# Altium schematic sheet LCD.SchDoc
size Tabloid
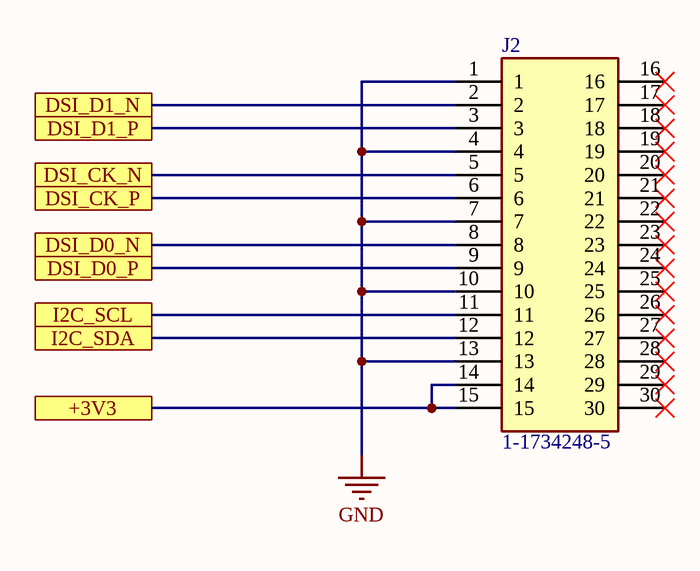
[diagram p0: LCD.SchDoc]

## Parts
J2  1-1734248-5  [117342485]

## Ports
+3V3, DSI_CK_N, DSI_CK_P, DSI_D0_N, DSI_D0_P, DSI_D1_N, DSI_D1_P, I2C_SCL, I2C_SDA

## Nets
GND: J2.1 J2.4 J2.7 J2.10 J2.13
+3V3: J2.14 J2.15 ; port +3V3
DSI_CK_N: J2.5 ; port DSI_CK_N
DSI_CK_P: J2.6 ; port DSI_CK_P
DSI_D0_N: J2.8 ; port DSI_D0_N
DSI_D0_P: J2.9 ; port DSI_D0_P
DSI_D1_N: J2.2 ; port DSI_D1_N
DSI_D1_P: J2.3 ; port DSI_D1_P
I2C_SCL: J2.11 ; port I2C_SCL
I2C_SDA: J2.12 ; port I2C_SDA

Not connected (* = marked no-connect by the designer): J2 16* 17* 18* 19* 20* 21* 22* 23* 24* 25* 26* 27* 28* 29* 30*

## Notes on the sheet
- Title
- Size:
- Date:
- Tabloid
- Number:
- Time:
- Revision:
- Sheet
- of
- File:

## Library data of the parts
J2 = 1-1734248-5: Connector; Manufacturer_Name: TE Connectivity; Datasheet Link: https://www.te.com/commerce/DocumentDelivery/DDEController?Action=showdoc&DocId=Customer+Drawing%7F1734248%7FE1%7Fpdf%7FEnglish%7FENG_CD_1734248_E1__.pdf%7F1-1734248-5; Height: 7.7mm; Manufacturer_Part_Number: 1-1734248-5; Mouser Part Number: 571-1-1734248-5; Mouser Price/Stock: https://www.mouser.co.uk/ProductDetail/TE-Connectivity/1-1734248-5/?qs=GQ3BsEl46pkrMd7Fg9TUQQ%3D%3D; Arrow Part Number: 1-1734248-5; Arrow Price/Stock: https://www.arrow.com/en/products/1-1734248-5/te-connectivity